# EAGLE design microsd (EAGLE 6.3)
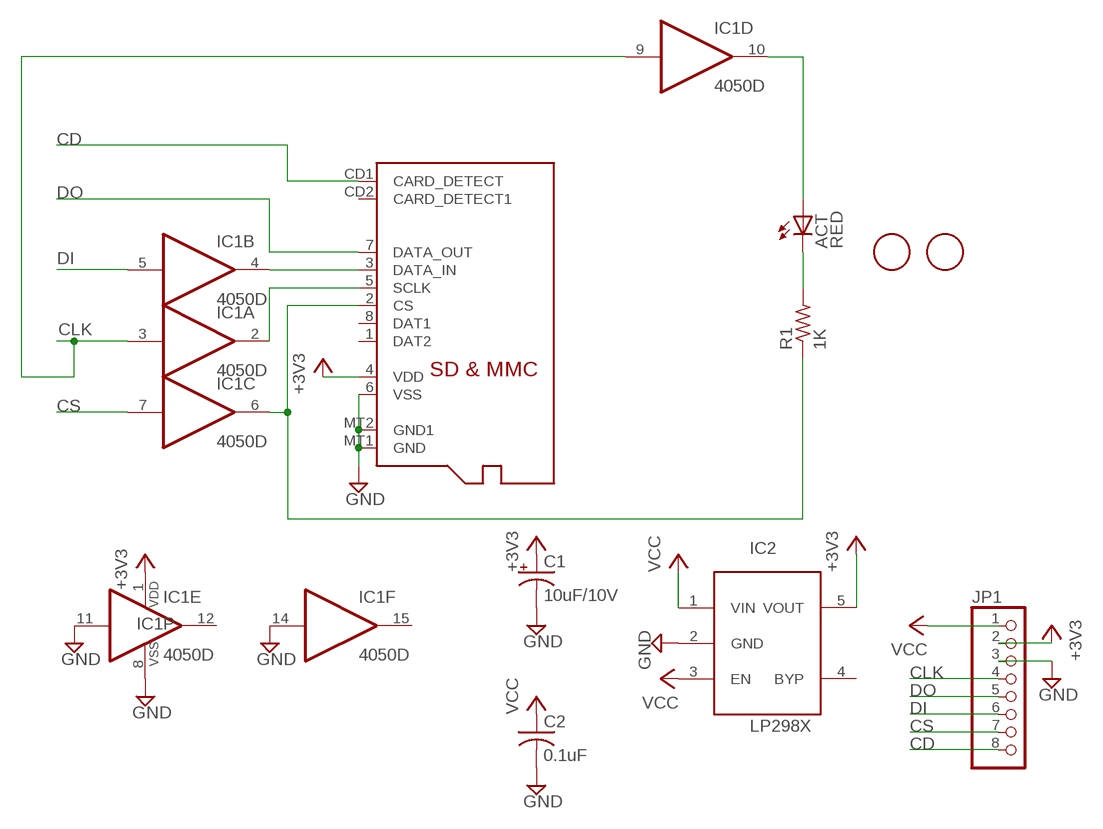
[diagram p0: schematic, sheet 1]

## Parts
ACT  RED  LEDCHIP-LED0805  [CHIP-LED0805]
C1  10uF/10V  CPOL-USA/3216-18R  [A/3216-18R]
C2  0.1uF  C-USC0805K  [C0805K]
IC1  4050D  [SO16]
IC2  LP298XS  [SOT23-5L]
JP1  PINHD-1X8BIG  [1X08-BIG]
R1  1K  R-US_R0805  [R0805]
U$1  FIDUCIAL  [FIDUCIAL_1MM]
U$2  FIDUCIAL  [FIDUCIAL_1MM]
X1  MICROSD  [MICROSD]

## Nets
+3V3: C1.+ IC1.1(P:VDD) IC2.5(VOUT) JP1.2 X1.4(VDD)
CD: JP1.8 X1.CD1(CARD_DETECT)
CLK: IC1.3(A:I) IC1.9(D:I) JP1.4
CS: IC1.7(C:I) JP1.7
DI: IC1.5(B:I) JP1.6
DO: JP1.5 X1.7(DATA_OUT)
GND: C1.- C2.2 IC1.8(P:VSS) IC1.11(E:I) IC1.14(F:I) IC2.2(GND) JP1.3 X1.6(VSS) X1.MT1(GND) X1.MT2(GND1)
N$1: ACT.A IC1.10(D:O)
N$2: IC1.2(A:O) X1.5(SCLK)
N$3: IC1.6(C:O) R1.1 X1.2(CS)
N$4: ACT.C R1.2
N$5: IC1.4(B:O) X1.3(DATA_IN)
VCC: C2.1 IC2.1(VIN) IC2.3(EN) JP1.1
Unconnected: IC1.12(E:O) IC1.15(F:O) IC2.4(BYP) X1.1(DAT2) X1.8(DAT1) X1.CD2(CARD_DETECT1)

## Library data of the parts
ACT = adafruit:LED: LED OSRAM: - CHIPLED LG R971, LG N971, LY N971, LG Q971, LY Q971, LO R971, LY R971 LH N974, LH R974 LS Q976, LO Q976, LY Q976 LO Q996 - Hyper CHIPLED LW Q18S LB Q993, LB Q99A, LB R99A - SideLED LS A670, LO A670, LY A670, LG A670, LP A670 LB A673, LV A673, LT A673, LW A673 LH A674 LY A675 LS A676, LA A676, LO A676, LY A676, LW A676 LS A679, LY A679, LG A679 - Hyper Micro SIDELED® LS Y876, LA Y876, LO Y876, LY Y876 LT Y87S - SmartLED LW L88C, LW L88S LB L89C, LB L89S, LG L890 LS L89K, LO L89K, LY L89K LS L896, LA L896, LO L896, LY L896 - TOPLED LS T670, LO T670, LY T670, LG T670, LP T670 LSG T670, LSP T670, LSY T670, LOP T670, LYG T670 LG T671, LOG T671, LSG T671 LB T673, LV T673, LT T673, LW T673 LH T674 LS T676, LA T676, LO T676, LY T676, LB T676, LH T676, LSB T676, LW T676 LB T67C, LV T67C, LT T67C, LS T67K, LO T67K, LY T67K, LW E67C LS E67B, LA E67B, LO E67B, LY E67B, LB E67C, LV E67C, LT E67C LW T67C LS T679, LY T679, LG T679 LS T770, LO T770, LY T770, LG T770, LP T770 LB T773, LV T773, LT T773, LW T773 LH T774 LS E675, LA E675, LY E675, LS T675 LS T776, LA T776, LO T776, LY T776, LB T776 LHGB T686 LT T68C, LB T68C - Hyper Mini TOPLED® LB M676 - Mini TOPLED Santana® LG M470 LS M47K, LO M47K, LY M47K Source: http://www.osram.convergy.de/
C1 = adafruit:CPOL-US: POLARIZED CAPACITOR, American symbol
C2 = adafruit:C-US: CAPACITOR, American symbol
IC1 = 40xx:4050: Hex non-inverting BUFFER
IC2 = adafruit:LP298X
JP1 = adafruit:PINHD-1X8: PIN HEADER
R1 = adafruit:R-US_: RESISTOR, American symbol
U$1 U$2 = adafruit:FIDUCIAL: For use by pick and place machines to calibrate the vision/machine, 1mm By microbuilder.eu
X1 = adafruit:MICROSD: Micro-SD / Transflash card holder with SPI pinout For the 3M # 2908-05WB-MG and/or 4UCON #19656 push-push type

## Board
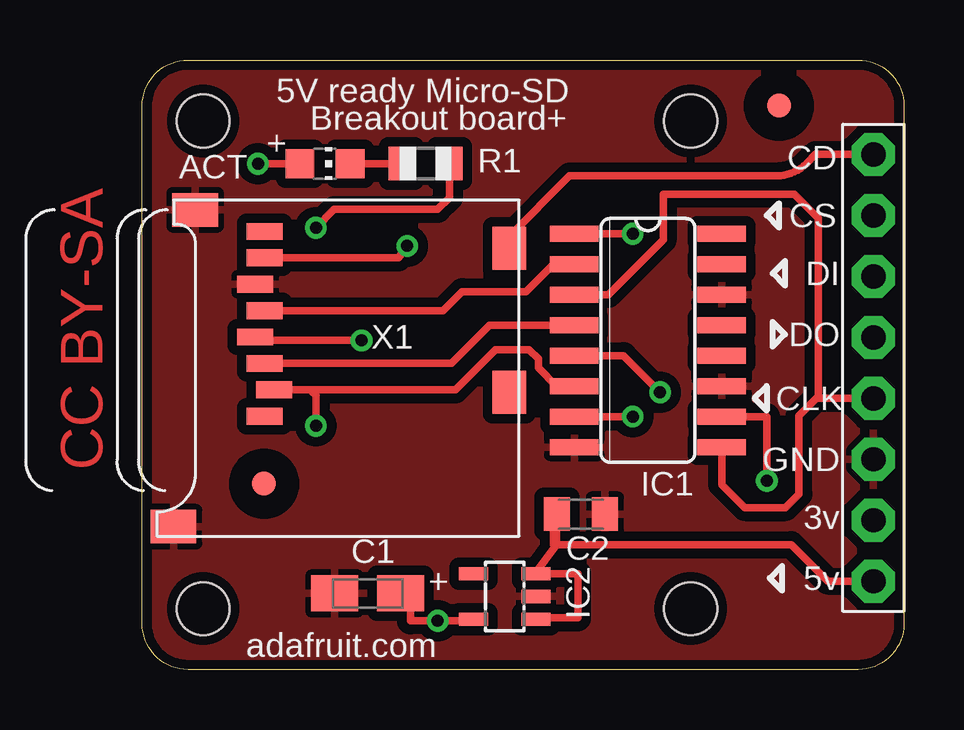
[diagram p1: board, top side]
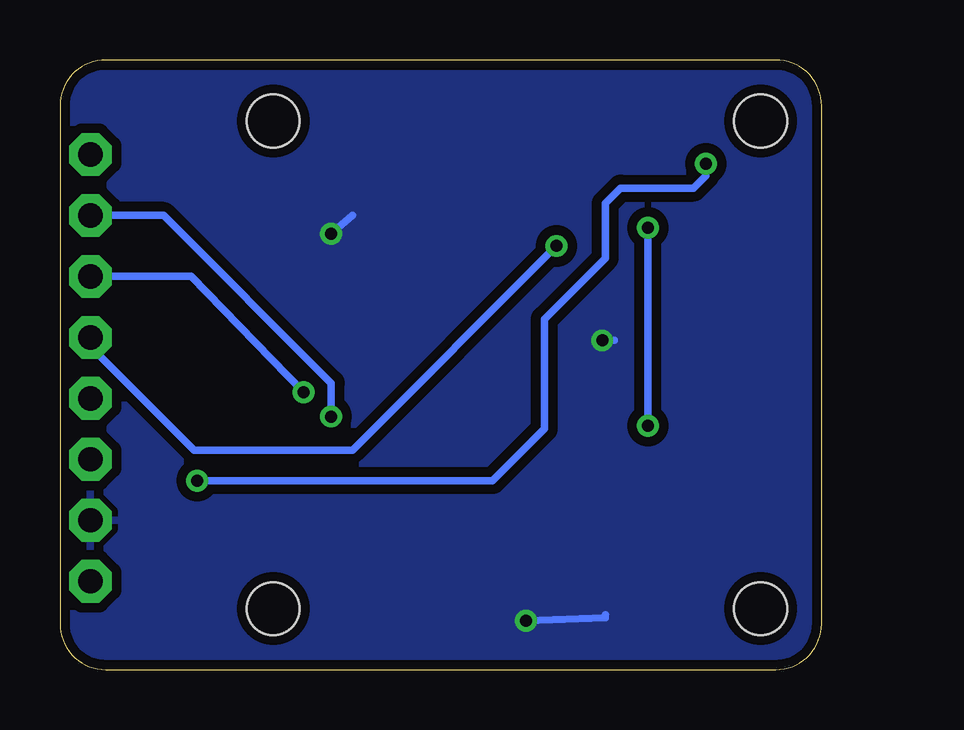
[diagram p2: board, bottom side, seen from below]

Size 31.75 x 25.4 mm. Coordinates in mm from the lower left corner, seen from the top.
Outline: 31.75,1.91 arc-90 29.84,0 1.91,0 arc-90 0,1.91 0,23.5 arc-90 1.91,25.4 29.84,25.4 arc-90 31.75,23.5 31.75,1.91
Copper layers (1*16): Top 0.035mm / dielectric 1.5mm / Bottom 0.035mm
Design rules "default *": minimum track width 12mil, minimum drill 19mil, track to track 12mil, track to pad 12mil, pad to pad 12mil, via to via 12mil, smd to smd 0mil, copper to edge 10mil, drill to drill 8mil, minimum pad ring 10mil, minimum via ring 8mil, stop-mask expansion 4mil, vias tented up to drill 20mil, thermal gap 10mil
Holes 2.2 mm at 2.54,22.86 2.54,2.54 22.86,22.86 22.86,2.54

### Footprints (pad centres in the part's own frame; a part is rotated, then mirrored left to right if it is on the bottom)
CHIP-LED0805 = smd 1.2 x 1.2: A 0,-1.05; C 0,1.05
A/3216-18R = smd 1.95 x 1.5: + 1.375,0; - -1.375,0
C0805K = smd 1.1 x 1.4: 1 -1,0; 2 1,0
SO16 = smd 0.66 x 2.032: 1 -4.445,-3.073; 2 -3.175,-3.073; 3 -1.905,-3.073; 4 -0.635,-3.073; 5 0.635,-3.073; 6 1.905,-3.073; 7 3.175,-3.073; 8 4.445,-3.073; 9 4.445,3.073; 10 3.175,3.073; 11 1.905,3.073; 12 0.635,3.073; 13 -0.635,3.073; 14 -1.905,3.073; 15 -3.175,3.073; 16 -4.445,3.073
SOT23-5L = smd 0.55 x 1.2: 1 -0.95,-1.3; 2 0,-1.3; 3 0.95,-1.3; 4 0.95,1.3; 5 -0.95,1.3
1X08-BIG = drill 1.016 pad 1.778 octagon: 1 -8.89,0; 2 -6.35,0; 3 -3.81,0; 4 -1.27,0; 5 1.27,0; 6 3.81,0; 7 6.35,0; 8 8.89,0
R0805 = smd 1.1 x 1.4: 1 -1,0; 2 1,0
FIDUCIAL_1MM = smd 1 x 1: 1 0,0
MICROSD = smd 0.7 x 1.5: 1 9,-10.64; 2 7.9,-10.24; 3 6.8,-10.64; 4 5.7,-11.04; 5 4.6,-10.64; 6 3.5,-11.04; 7 2.4,-10.64; 8 1.3,-10.64 | smd 1.8 x 1.4: CD1 2,-0.44; CD2 8,-0.44 | smd 1.4 x 1.9: MT1 0.4,-13.54; MT2 13.6,-14.44

### Placement (x,y rotation side)
ACT  7.62,21.08 270 top
C1  9.4,3.17 0 top
C2  18.29,6.48 0 top
IC1  21.08,13.72 270 top
IC2  15.11,3.05 90 top
JP1  30.48,12.57 90 top
R1  11.81,21.08 180 top
U$1  5.08,7.75 0 top
U$2  26.54,23.5 0 top
X1  15.75,19.56 270 top

### Tracks (layer width: path | path; a pad name or v marks a point on that pad's centre or on a via)
+3V3  (via drill 0.5)
  Top 0.305: IC1.1 v20.45,18.16 | X1.4 4.72,13.72 v9.14,13.72 | v12.32,2.03 12.35,2.03 | IC2.5 13.75,2.03 v12.32,2.03 | C1.+ 11.18,3.17 11.18,2.03 v12.32,2.03
  Bottom 0.305: v20.45,18.16 19.56,18.92 | v9.14,13.72 8.64,13.72 | v12.32,2.03 9.02,2.16 9.02,2.29
  pour Bottom (isolate 0.406): 0,25.4 0,0 30.1,0 arc90 31.88,1.78 31.88,25.4
CD
  Top 0.305: X1.CD1 15.24,17.27 15.24,18 17.82,20.57 26.44,20.57 arc45 27.7,21.09 28.07,21.46 JP1.8 30.86,21.46
CLK
  Top 0.305: IC1.3 19.43,15.62 21.72,17.91 21.72,19.81 27.18,19.81 28.19,18.8 28.19,11.3 | 30.73,11.3 JP1.4 28.19,11.3 | IC1.9 24.16,7.71 25.12,6.75 26.81,6.75 27.38,7.32 27.38,10.59 28.11,11.32 28.13,11.3 28.19,11.3
CS  (via drill 0.5)
  Top 0.305: IC1.7 v20.45,10.54
  Bottom 0.305: v20.45,10.54 20.45,11.94 27.43,18.92 28.83,18.92 JP1.7 30.73,18.92
DI  (via drill 0.5)
  Top 0.305: v21.59,11.56 20.07,13.08 18.09,13.08 18.01,13.16 | 18.01,13.16 18,13.17 | IC1.5 18.01,13.16
  Bottom 0.305: v21.59,11.56 26.29,16.38 JP1.6
DO  (via drill 0.5)
  Top 0.305: X1.7 10.68,17.16 v11.05,17.65
  Bottom 0.305: v11.05,17.65 19.56,9.14 26.16,9.14 30.73,13.72 30.73,13.84 JP1.5
GND
  pour Top (isolate 0.406): -0.13,25.4 -0.13,0 31.75,0 31.75,25.4
N$1  (via drill 0.5)
  Top 0.305: v4.83,21.08 ACT.A | IC1.10 26.04,10.54 v26.04,7.87
  Bottom 0.305: v26.04,7.87 13.72,7.87 11.56,10.03 11.56,14.61 9.02,17.14 9.02,19.43 8.38,20.07 5.33,20.07 4.83,20.57 v4.83,21.08
N$2
  Top 0.305: X1.5 12.54,14.96 13.34,15.75 16,15.75 17.14,16.89 IC1.2 18.16,16.89
N$3  (via drill 0.5)
  Top 0.305: X1.2 7.11,11.66 | 7.11,11.66 13.05,11.66 14.73,13.34 16.13,13.34 16.51,12.95 16.51,12.57 17.27,11.81 18.16,11.81 | 18.16,11.81 IC1.6 | 18.16,11.81 18.29,11.94 | R1.1 12.81,19.67 12.32,19.18 8,19.18 v7.24,18.41 | 7.11,11.66 7.11,11.56 7.24,11.43 v7.24,10.16
  Bottom 0.305: v7.24,10.16 v7.24,18.41
N$4
  Top 0.305: R1.2 10.81,21.19 10.79,21.21 10.67,21.08 ACT.C
N$5
  Top 0.305: X1.3 12.88,12.76 14.48,14.35 IC1.4
VCC
  Top 0.305: JP1.1 28.57,3.68 27.05,5.21 17.27,5.21 | 17.27,5.21 17.14,5.21 17.14,6.35 17.27,6.48 C2.1 17.27,5.21 | IC2.1 16.51,2.1 16.51,2.16 18.16,2.16 18.16,4 IC2.3 16.38,4 17.27,5.21

### Text on the board
Top: CC BY-SA
tPlace: 5V ready Micro-SD | Breakout board+ | adafruit.com
tNames: CD | CS | DI | DO | CLK | GND | 3v | 5v